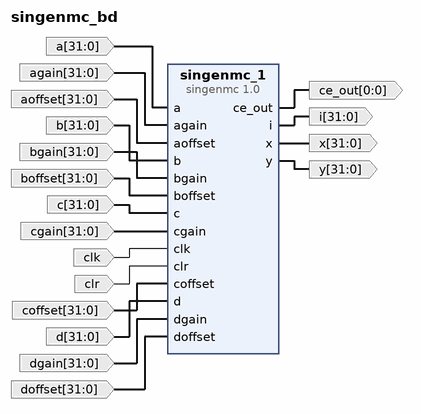
[diagram p0: block diagram of the top level]
# Vivado block design singenmc_bd, xc7z030sbg485-1, Vivado 2023.2
create_bd_design singenmc_bd

create_bd_port -dir I -from 31 -to 0 -type data a
create_bd_port -dir I -from 31 -to 0 -type data again
create_bd_port -dir I -from 31 -to 0 -type data aoffset
create_bd_port -dir I -from 31 -to 0 -type data b
create_bd_port -dir I -from 31 -to 0 -type data bgain
create_bd_port -dir I -from 31 -to 0 -type data boffset
create_bd_port -dir I -from 31 -to 0 -type data c
create_bd_port -dir O -from 0 -to 0 -type data ce_out
create_bd_port -dir I -from 31 -to 0 -type data cgain
create_bd_port -dir I -type clk clk
create_bd_port -dir I -type data clr
create_bd_port -dir I -from 31 -to 0 -type data coffset
create_bd_port -dir I -from 31 -to 0 -type data d
create_bd_port -dir I -from 31 -to 0 -type data dgain
create_bd_port -dir I -from 31 -to 0 -type data doffset
create_bd_port -dir O -from 31 -to 0 -type data i
create_bd_port -dir O -from 31 -to 0 -type data x
create_bd_port -dir O -from 31 -to 0 -type data y

create_bd_cell -type ip -vlnv MaxIV:Panda_ModelComp:singenmc:1.0 singenmc_1

# ---- connections ----

connect_bd_net [get_bd_ports a] [get_bd_pins singenmc_1/a]
connect_bd_net [get_bd_ports again] [get_bd_pins singenmc_1/again]
connect_bd_net [get_bd_ports aoffset] [get_bd_pins singenmc_1/aoffset]
connect_bd_net [get_bd_ports b] [get_bd_pins singenmc_1/b]
connect_bd_net [get_bd_ports bgain] [get_bd_pins singenmc_1/bgain]
connect_bd_net [get_bd_ports boffset] [get_bd_pins singenmc_1/boffset]
connect_bd_net [get_bd_ports c] [get_bd_pins singenmc_1/c]
connect_bd_net [get_bd_ports cgain] [get_bd_pins singenmc_1/cgain]
connect_bd_net [get_bd_ports clk] [get_bd_pins singenmc_1/clk]
connect_bd_net [get_bd_ports clr] [get_bd_pins singenmc_1/clr]
connect_bd_net [get_bd_ports coffset] [get_bd_pins singenmc_1/coffset]
connect_bd_net [get_bd_ports d] [get_bd_pins singenmc_1/d]
connect_bd_net [get_bd_ports dgain] [get_bd_pins singenmc_1/dgain]
connect_bd_net [get_bd_ports doffset] [get_bd_pins singenmc_1/doffset]
connect_bd_net [get_bd_pins singenmc_1/ce_out] [get_bd_ports ce_out]
connect_bd_net [get_bd_pins singenmc_1/i] [get_bd_ports i]
connect_bd_net [get_bd_pins singenmc_1/x] [get_bd_ports x]
connect_bd_net [get_bd_pins singenmc_1/y] [get_bd_ports y]

validate_bd_design
save_bd_design
